# EAGLE design TheRightHandPathSVG (EAGLE 9.6.0)

## Sheet 1 of 2
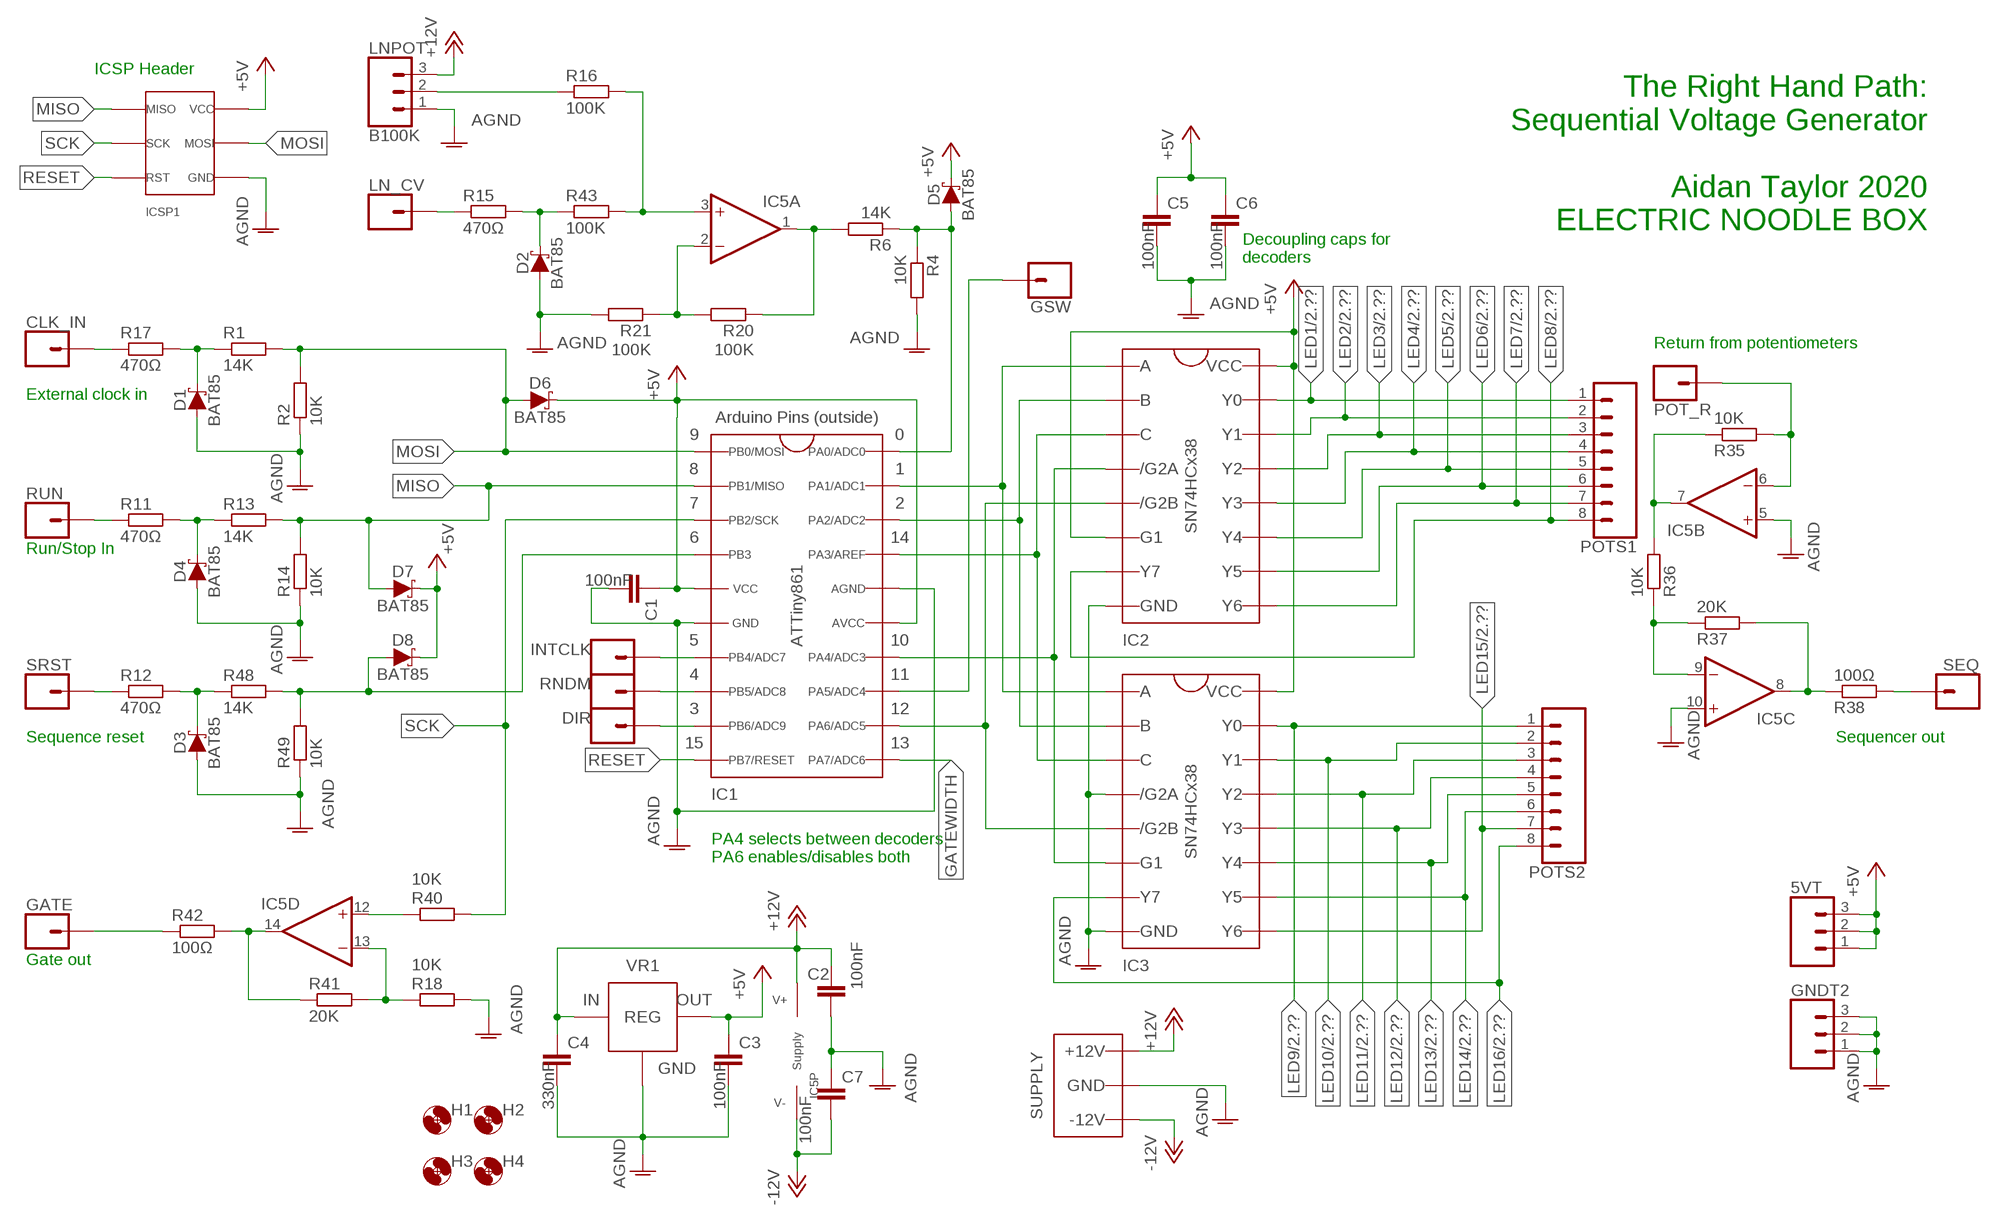
[diagram p0: schematic, sheet 1]

### Parts
5VT  3XWIREPAD  [1X03]
C1  100nF  C-EU050-025X075  [C050-025X075]
C2  100nF  C-EU050-025X075  [C050-025X075]
C3  100nF  C-EU050-025X075  [C050-025X075]
C4  330nF  C-EU050-025X075  [C050-025X075]
C5  100nF  C-EU050-025X075  [C050-025X075]
C6  100nF  C-EU050-025X075  [C050-025X075]
C7  100nF  C-EU050-025X075  [C050-025X075]
CLK_IN  1XWIREPAD  [1X01]
D1  BAT85  SCHOTTKY_DO35  [DO35-7]
D2  BAT85  SCHOTTKY_DO35  [DO35-7]
D3  BAT85  SCHOTTKY_DO35  [DO35-7]
D4  BAT85  SCHOTTKY_DO35  [DO35-7]
D5  BAT85  SCHOTTKY_DO35  [DO35-7]
D6  BAT85  SCHOTTKY_DO35  [DO35-7]
D7  BAT85  SCHOTTKY_DO35  [DO35-7]
D8  BAT85  SCHOTTKY_DO35  [DO35-7]
DIR  1XWIREPAD  [1X01]
GATE  1XWIREPAD  [1X01]
GNDT2  3XWIREPAD  [1X03]
GSW  1XWIREPAD  [1X01]
H1  MOUNT-HOLE3.2  [3,2]
H2  MOUNT-HOLE3.2  [3,2]
H3  MOUNT-HOLE3.2  [3,2]
H4  MOUNT-HOLE3.2  [3,2]
IC1  ATTINY861  [DIL20]
IC2  SN74HCX38  [DIL16]
IC3  SN74HCX38  [DIL16]
IC5  TL0X4DIL  [DIL14]
ICSP1  ICSP_2.54  [2X3]
INTCLK  1XWIREPAD  [1X01]
LN_CV  1XWIREPAD  [1X01]
LNPOT  B100K  3XWIREPAD  [1X03]
POT_R  1XWIREPAD  [1X01]
POTS1  8XWIREPAD  [1X08]
POTS2  8XWIREPAD  [1X08]
R1  14K  R-EU_0207/10  [0207/10]
R2  10K  R-EU_0207/10  [0207/10]
R4  10K  R-EU_0207/10  [0207/10]
R6  14K  R-EU_0207/10  [0207/10]
R11  470Ω  R-EU_0207/10  [0207/10]
R12  470Ω  R-EU_0207/10  [0207/10]
R13  14K  R-EU_0207/10  [0207/10]
R14  10K  R-EU_0207/10  [0207/10]
R15  470Ω  R-EU_0207/10  [0207/10]
R16  100K  R-EU_0207/10  [0207/10]
R17  470Ω  R-EU_0207/10  [0207/10]
R18  10K  R-EU_0207/10  [0207/10]
R20  100K  R-EU_0207/10  [0207/10]
R21  100K  R-EU_0207/10  [0207/10]
R35  10K  R-EU_0207/10  [0207/10]
R36  10K  R-EU_0207/10  [0207/10]
R37  20K  R-EU_0207/10  [0207/10]
R38  100Ω  R-EU_0207/10  [0207/10]
R40  10K  R-EU_0207/10  [0207/10]
R41  20K  R-EU_0207/10  [0207/10]
R42  100Ω  R-EU_0207/10  [0207/10]
R43  100K  R-EU_0207/10  [0207/10]
R48  14K  R-EU_0207/10  [0207/10]
R49  10K  R-EU_0207/10  [0207/10]
RNDM  1XWIREPAD  [1X01]
RUN  1XWIREPAD  [1X01]
SEQ  1XWIREPAD  [1X01]
SRST  1XWIREPAD  [1X01]
VR1  L78L05TO92  [TO92]
WP1  COMBO_SUPPLY_HEADER  [COMBINED_POWER]

### Nets
+5V: 5VT.1 5VT.2 5VT.3 C1.1 C3.1 C5.1 C6.1 D5.C D6.C D7.C D8.C IC1.5(VCC) IC1.15(AVCC) IC2.6(6_G1) IC2.16(16_VCC) IC3.16(16_VCC) ICSP1.2(6VCC) VR1.1(VOUT) ; also sheet 2
+12V: C2.1 C4.1 IC5.4(P:V+) LNPOT.3 VR1.3(VIN) WP1.V+1(V++) WP1.V+2(V++) WP1.V+3(V++) ; also sheet 2
-12V: C7.2 IC5.11(P:V-) WP1.V-1(V--) WP1.V-2(V--) WP1.V-3(V--)
AGND: C1.2 C2.2 C3.2 C4.2 C5.2 C6.2 C7.1 D1.A D2.A D3.A D4.A GNDT2.1 GNDT2.2 GNDT2.3 IC1.6(GND) IC1.16(AGND) IC2.8(8_GND) IC3.4(4_/G2A) IC3.8(8_GND) IC5.5(B:+IN) IC5.10(C:+IN) ICSP1.6(4GND) LNPOT.1 R2.1 R4.2 R14.1 R18.2 R21.2 R49.1 VR1.2(GND) WP1.GND1(AGND) WP1.GND2(AGND) WP1.GND3(AGND) WP1.GND4(AGND) WP1.GND5(AGND) WP1.GND6(AGND) WP1.GND7(AGND) WP1.GND8(AGND) ; also sheet 2
GATEWIDTH: IC1.11(11_PA7)
LED1: IC2.15(15_Y0) POTS1.1 ; also sheet 2
LED2: IC2.14(14_Y1) POTS1.2 ; also sheet 2
LED3: IC2.13(13_Y2) POTS1.3 ; also sheet 2
LED4: IC2.12(12_Y3) POTS1.4 ; also sheet 2
LED5: IC2.11(11_Y4) POTS1.5 ; also sheet 2
LED6: IC2.10(10_Y5) POTS1.6 ; also sheet 2
LED7: IC2.9(9_Y6) POTS1.7 ; also sheet 2
LED8: IC2.7(7_Y7) POTS1.8 ; also sheet 2
LED9: IC3.15(15_Y0) POTS2.1 ; also sheet 2
LED10: IC3.14(14_Y1) POTS2.2 ; also sheet 2
LED11: IC3.13(13_Y2) POTS2.3 ; also sheet 2
LED12: IC3.12(12_Y3) POTS2.4 ; also sheet 2
LED13: IC3.11(11_Y4) POTS2.5 ; also sheet 2
LED14: IC3.10(10_Y5) POTS2.6 ; also sheet 2
LED15: IC3.9(9_Y6) POTS2.7 ; also sheet 2
LED16: IC3.7(7_Y7) POTS2.8 ; also sheet 2
MISO: D7.A IC1.2(2_PB1) ICSP1.1(1MISO) R13.2 R14.2
MOSI: D6.A IC1.1(1_PB0) ICSP1.4(5MOSI) R1.2 R2.2
N2V5REF: IC5.2(A:-IN) R20.2 R21.1
N$1: IC1.14(14_PA4) IC2.4(4_/G2A) IC3.6(6_G1)
N$2: IC1.17(17_PA3) IC2.3(3_C) IC3.3(3_C)
N$3: IC1.18(18_PA2) IC2.2(2_B) IC3.2(2_B)
N$4: IC1.19(19_PA1) IC2.1(1_A) IC3.1(1_A)
N$5: D4.C R11.2 R13.1
N$6: GSW.1 IC1.13(13_PA5)
N$8: D1.C R1.1 R17.2
N$9: D2.C R15.2 R43.1
N$11: IC1.7(7_PB4) INTCLK.1
N$13: IC1.12(12_PA6) IC2.5(5_/G2B) IC3.5(5_/G2B)
N$15: IC5.1(A:OUT) R6.2 R20.1
N$17: D5.A IC1.20(20_PA0) R4.1 R6.1
N$19: R11.1 RUN.1
N$21: D3.C R12.2 R48.1
N$23: LN_CV.1 R15.1
N$25: R12.1 SRST.1
N$27: LNPOT.2 R16.1
N$29: CLK_IN.1 R17.1
N$44: IC5.14(D:OUT) R41.1 R42.2
N$46: IC5.13(D:-IN) R18.1 R41.2
N$48: IC5.6(B:-IN) POT_R.1 R35.2
N$59: IC5.7(B:OUT) R35.1 R36.2
N$60: IC5.9(C:-IN) R36.1 R37.1
N$61: R38.2 SEQ.1
N$62: IC5.8(C:OUT) R37.2 R38.1
N$63: IC5.12(D:+IN) R40.1
N$64: GATE.1 R42.1
N$67: IC5.3(A:+IN) R16.2 R43.2
N$73: IC1.8(8_PB5) RNDM.1
N$74: DIR.1 IC1.9(9_PB6)
N$77: D8.A IC1.4(4_PB3) R48.2 R49.2
RESET: IC1.10(10_PB7) ICSP1.5(3RST)
SCK: IC1.3(3_PB2) ICSP1.3(2SCK) R40.2

### Notes on the sheet
- ICSP Header
- The Right Hand Path:
  Sequential Voltage Generator
  
  Aidan Taylor 2020
  ELECTRIC NOODLE BOX
- Decoupling caps for
  decoders
- Return from potentiometers
- External clock in
- Run/Stop In
- Sequence reset | Sequencer out
- PA4 selects between decoders
  PA6 enables/disables both
- Gate out

## Sheet 2 of 2
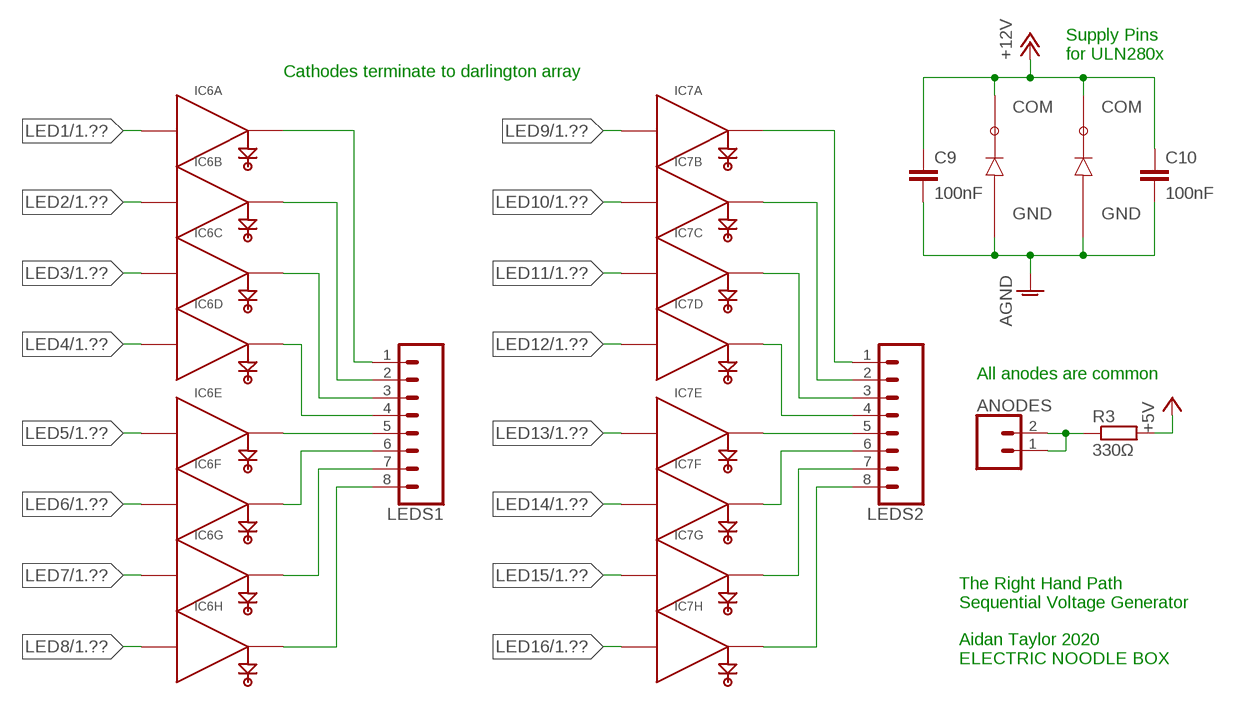
[diagram p1: schematic, sheet 2]

### Parts
ANODES  2XWIREPAD  [1X02]
C9  100nF  C-EU050-025X075  [C050-025X075]
C10  100nF  C-EU050-025X075  [C050-025X075]
IC6  ULN2801  [DIL18]
IC7  ULN2801  [DIL18]
LEDS1  8XWIREPAD  [1X08]
LEDS2  8XWIREPAD  [1X08]
R3  330Ω  R-EU_0207/10  [0207/10]

### Nets
+5V: R3.2 ; also sheet 1
+12V: C9.1 C10.1 IC6.10(COM) IC7.10(COM) ; also sheet 1
AGND: C9.2 C10.2 IC6.9(GND) IC7.9(GND) ; also sheet 1
LED1: IC6.1(A:IN) ; also sheet 1
LED2: IC6.2(B:IN) ; also sheet 1
LED3: IC6.3(C:IN) ; also sheet 1
LED4: IC6.4(D:IN) ; also sheet 1
LED5: IC6.5(E:IN) ; also sheet 1
LED6: IC6.6(F:IN) ; also sheet 1
LED7: IC6.7(G:IN) ; also sheet 1
LED8: IC6.8(H:IN) ; also sheet 1
LED9: IC7.1(A:IN) ; also sheet 1
LED10: IC7.2(B:IN) ; also sheet 1
LED11: IC7.3(C:IN) ; also sheet 1
LED12: IC7.4(D:IN) ; also sheet 1
LED13: IC7.5(E:IN) ; also sheet 1
LED14: IC7.6(F:IN) ; also sheet 1
LED15: IC7.7(G:IN) ; also sheet 1
LED16: IC7.8(H:IN) ; also sheet 1
N$7: ANODES.1 ANODES.2 R3.1
N$10: IC6.18 LEDS1.1
N$12: IC6.17 LEDS1.2
N$14: IC6.16 LEDS1.3
N$16: IC6.15 LEDS1.4
N$18: IC6.14 LEDS1.5
N$20: IC6.13 LEDS1.6
N$22: IC6.12 LEDS1.7
N$24: IC6.11 LEDS1.8
N$26: IC7.18 LEDS2.1
N$28: IC7.17 LEDS2.2
N$30: IC7.16 LEDS2.3
N$32: IC7.15 LEDS2.4
N$34: IC7.14 LEDS2.5
N$36: IC7.13 LEDS2.6
N$38: IC7.12 LEDS2.7
N$40: IC7.11 LEDS2.8

### Notes on the sheet
- Supply Pins
  for ULN280x
- Cathodes terminate to darlington array
- All anodes are common
- The Right Hand Path
  Sequential Voltage Generator
  
  Aidan Taylor 2020
  ELECTRIC NOODLE BOX

## Library data of the parts
5VT GNDT2 LNPOT = ElectricNoodleBox:3XWIREPAD
ANODES = ElectricNoodleBox:2XWIREPAD
C1-C7 C9 C10 = rcl:C-EU: CAPACITOR, European symbol; SPICEPREFIX: C
CLK_IN DIR GATE GSW INTCLK LN_CV POT_R RNDM RUN SEQ SRST = ElectricNoodleBox:1XWIREPAD
D1-D8 = ElectricNoodleBox:SCHOTTKY_DO35
H1-H4 = holes:MOUNT-HOLE: MOUNTING HOLE with drill center marker
IC1 = ElectricNoodleBox:ATTINY861
IC2 IC3 = ElectricNoodleBox:SN74HCX38
IC5 = ElectricNoodleBox:TL0X4
IC6 IC7 = ElectricNoodleBox:ULN2801
ICSP1 = ElectricNoodleBox:ICSP_2.54
LEDS1 LEDS2 POTS1 POTS2 = ElectricNoodleBox:8XWIREPAD
R1-R4 R6 R11-R18 R20 R21 R35-R38 R40-R43 R48 R49 = rcl:R-EU_: RESISTOR, European symbol; SPICEPREFIX: R
VR1 = ElectricNoodleBox:L78L05
WP1 = ElectricNoodleBox:COMBO_SUPPLY_HEADER

## Board
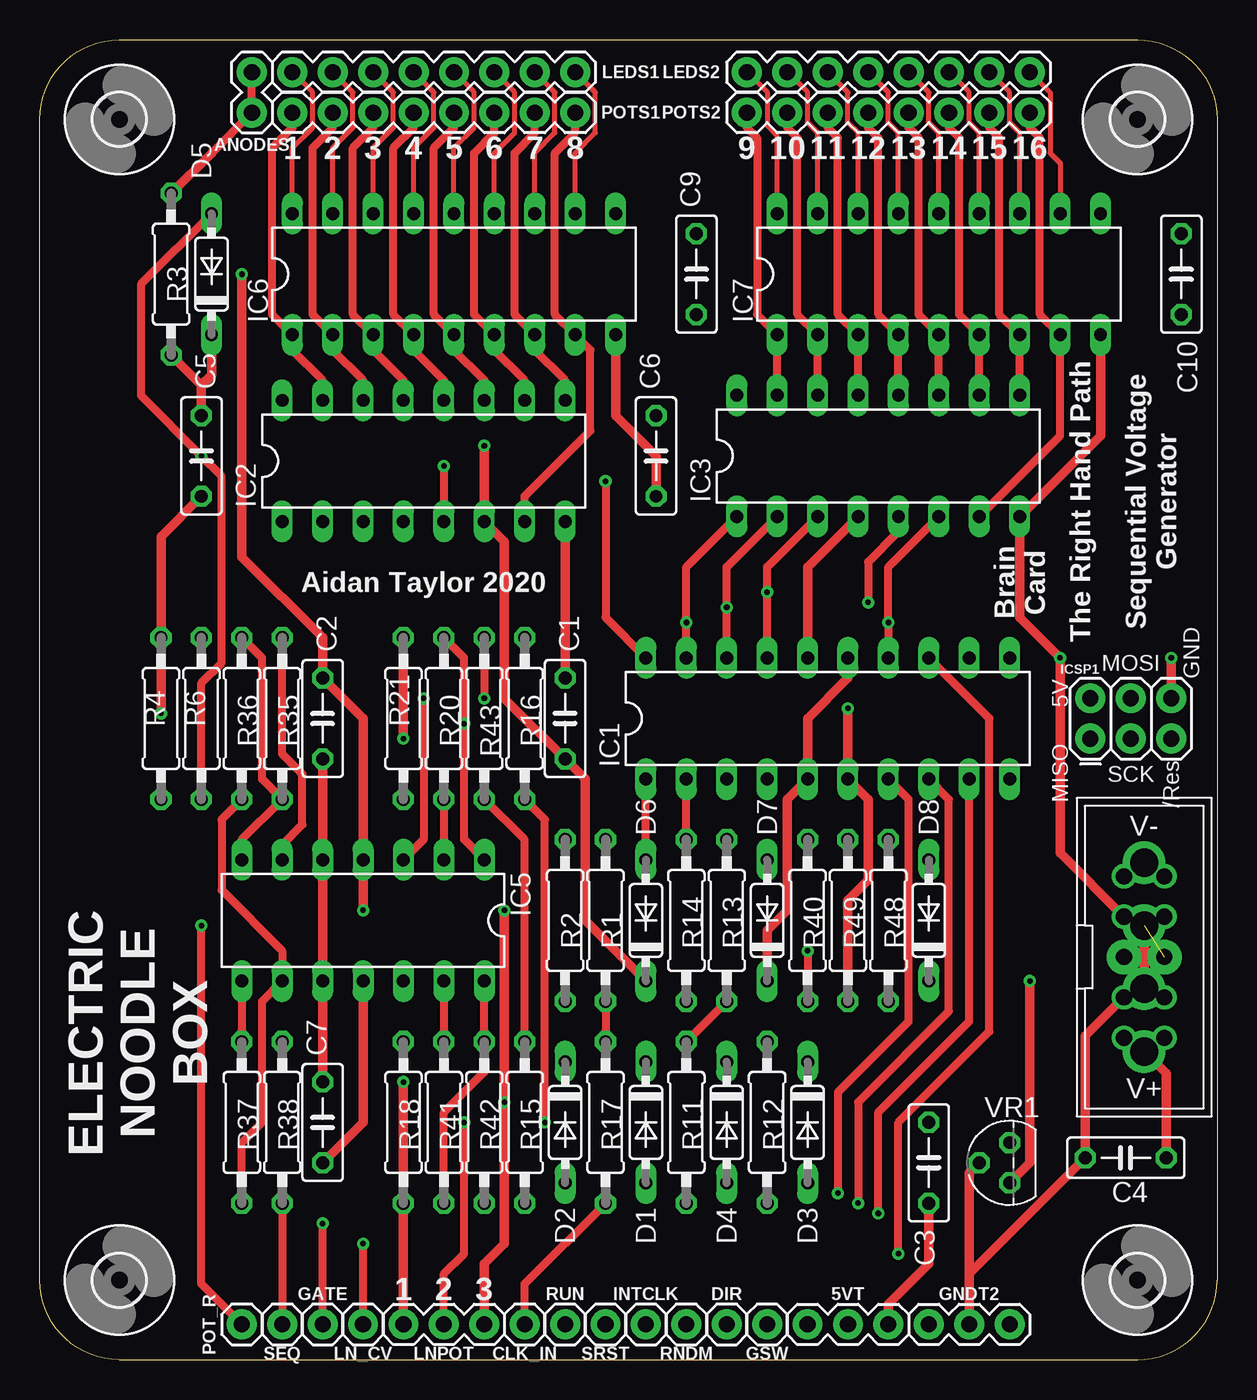
[diagram p2: board, top side]
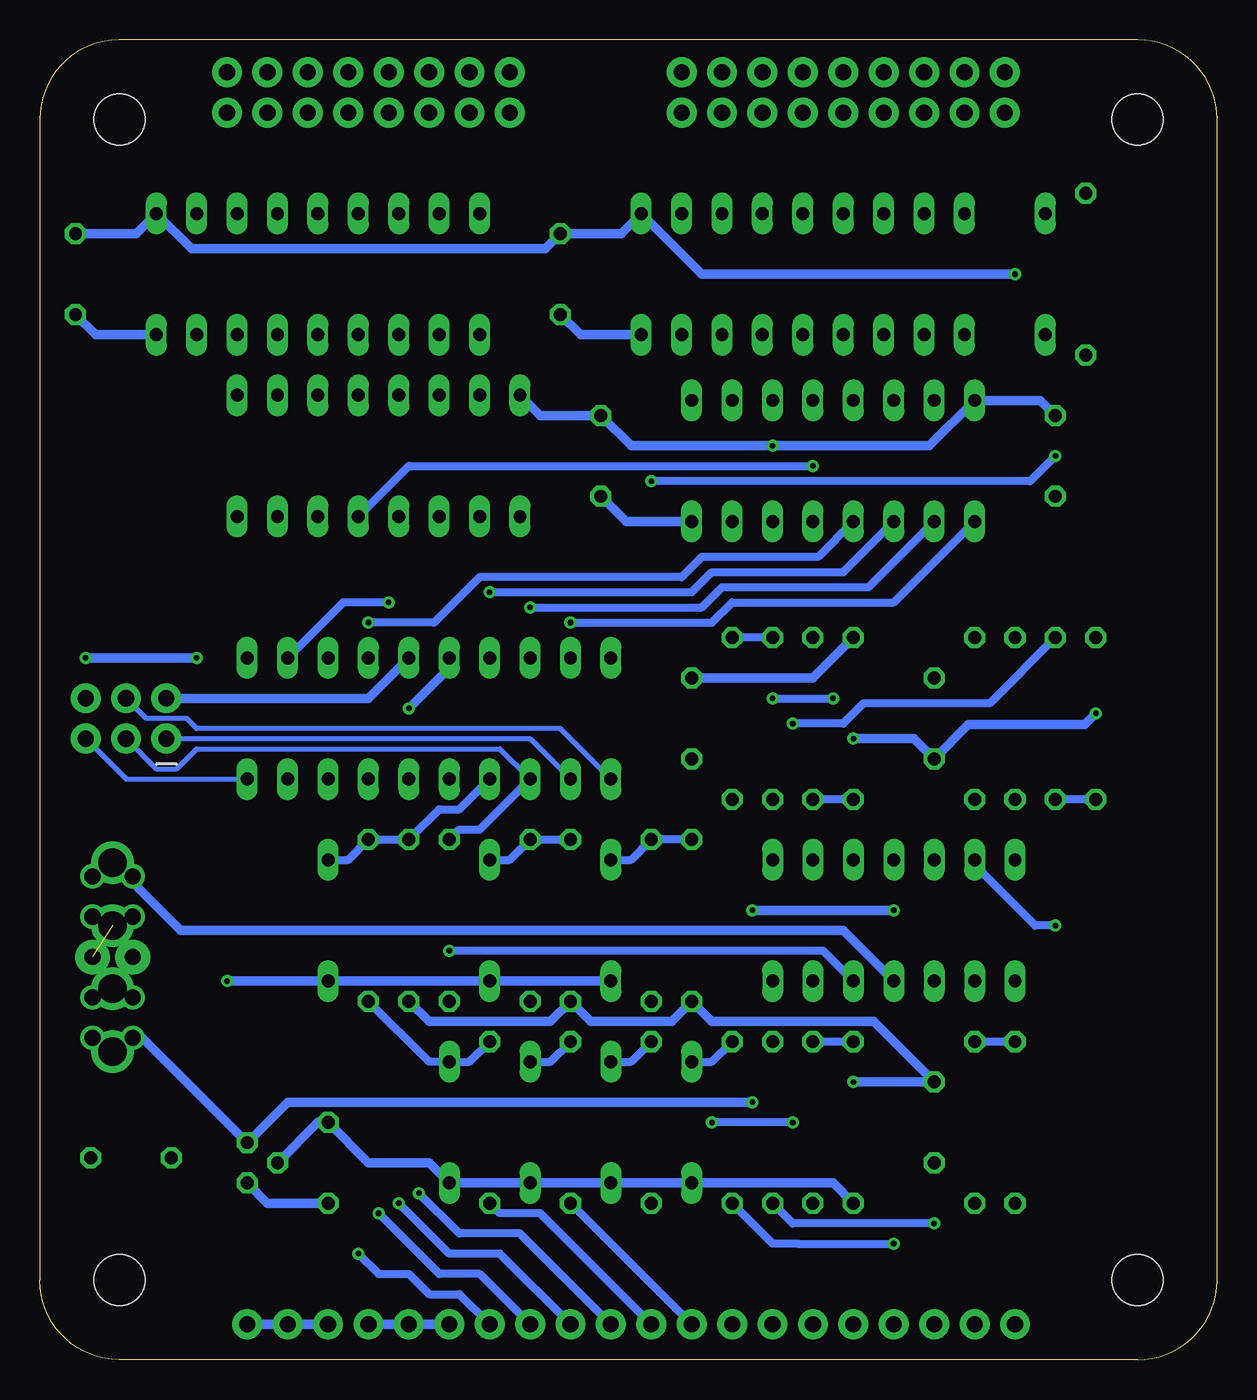
[diagram p3: board, bottom side, seen from below]

Size 74 x 83 mm. Coordinates in mm from the lower left corner, seen from the top.
Outline: 5,0 69,0 arc90 74,5 74,78 arc90 69,83 5,83 arc90 0,78 0,5 arc90 5,0
Copper layers (1*16): Top 0.035mm / dielectric 1.5mm / Bottom 0.035mm
Design rules "default": minimum track width 6mil, minimum drill 0.35mm, track to track 6mil, track to pad 6mil, pad to pad 6mil, via to via 6mil, smd to smd 6mil, copper to edge 40mil, drill to drill 6mil, minimum pad ring 10mil, minimum via ring 8mil, stop-mask expansion 4mil, vias tented up to drill 0mil, thermal gap 10mil

### Footprints (pad centres in the part's own frame; a part is rotated, then mirrored left to right if it is on the bottom)
1X03 = drill 1.016 pad 1.88: 1 0,0; 2 2.54,0; 3 5.08,0
1X02 = drill 1.016 pad 1.88: 1 0,0; 2 2.54,0
C050-025X075 = drill 0.813 octagon: 1 -2.54,0; 2 2.54,0
1X01 = drill 1.016 pad 1.88: 1 0,0
DO35-7 = drill 0.813 long: A 3.81,0; C -3.81,0
3,2 = hole 3.2: 0,0
DIL20 = drill 0.813 long: 1 -11.43,-3.81; 2 -8.89,-3.81; 3 -6.35,-3.81; 4 -3.81,-3.81; 5 -1.27,-3.81; 6 1.27,-3.81; 7 3.81,-3.81; 8 6.35,-3.81; 9 8.89,-3.81; 10 11.43,-3.81; 11 11.43,3.81; 12 8.89,3.81; 13 6.35,3.81; 14 3.81,3.81; 15 1.27,3.81; 16 -1.27,3.81; 17 -3.81,3.81; 18 -6.35,3.81; 19 -8.89,3.81; 20 -11.43,3.81
DIL16 = drill 0.813 long: 1 -8.89,-3.81; 2 -6.35,-3.81; 3 -3.81,-3.81; 4 -1.27,-3.81; 5 1.27,-3.81; 6 3.81,-3.81; 7 6.35,-3.81; 8 8.89,-3.81; 9 8.89,3.81; 10 6.35,3.81; 11 3.81,3.81; 12 1.27,3.81; 13 -1.27,3.81; 14 -3.81,3.81; 15 -6.35,3.81; 16 -8.89,3.81
DIL14 = drill 0.813 long: 1 -7.62,-3.81; 2 -5.08,-3.81; 3 -2.54,-3.81; 4 0,-3.81; 5 2.54,-3.81; 6 5.08,-3.81; 7 7.62,-3.81; 8 7.62,3.81; 9 5.08,3.81; 10 2.54,3.81; 11 0,3.81; 12 -2.54,3.81; 13 -5.08,3.81; 14 -7.62,3.81
DIL18 = drill 0.813 long: 1 -10.16,-3.81; 2 -7.62,-3.81; 3 -5.08,-3.81; 4 -2.54,-3.81; 5 0,-3.81; 6 2.54,-3.81; 7 5.08,-3.81; 8 7.62,-3.81; 9 10.16,-3.81; 10 10.16,3.81; 11 7.62,3.81; 12 5.08,3.81; 13 2.54,3.81; 14 0,3.81; 15 -2.54,3.81; 16 -5.08,3.81; 17 -7.62,3.81; 18 -10.16,3.81
2X3 = drill 1.016 pad 1.88: 1 0,0; 2 0,2.54; 3 2.54,0; 4 2.54,2.54; 5 5.08,0; 6 5.08,2.54
1X08 = drill 1.016 pad 1.88: 1 0,0; 2 2.54,0; 3 5.08,0; 4 7.62,0; 5 10.16,0; 6 12.7,0; 7 15.24,0; 8 17.78,0
0207/10 = drill 0.813 octagon: 1 -5.08,0; 2 5.08,0
TO92 = drill 0.813 octagon: 1 -1.27,0; 2 0,1.905; 3 1.27,0
COMBINED_POWER = drill 1.78: GND1 -1.98,0; GND2 1.98,0; V+1 -5.94,0; V-1 5.94,0 | drill 1.016: GND3 -2.54,1.27; GND5 2.54,1.27; GND6 -2.54,-1.27; GND8 2.54,-1.27; V+2 -5.08,1.27; V+3 -5.08,-1.27; V-2 5.08,1.27; V-3 5.08,-1.27 | drill 1.016 pad 2.184: GND4 0,1.27; GND7 0,-1.27

### Placement (x,y rotation side)
5VT  48.26,2.22 0 top
ANODES  13.34,78.42 90 top
C1  33.02,40.32 90 top
C2  17.78,40.32 270 top
C3  55.88,12.38 90 top
C4  68.26,12.7 180 top
C5  10.16,56.83 270 top
C6  38.73,56.83 270 top
C7  17.78,14.92 270 top
C9  41.27,68.26 270 top
C10  71.75,68.26 270 top
CLK_IN  30.48,2.22 0 top
D1  38.1,14.92 270 top
D2  33.02,14.92 270 top
D3  48.26,14.92 270 top
D4  43.18,14.92 270 top
D5  10.79,68.26 90 top
D6  38.1,27.62 90 top
D7  45.72,27.62 90 top
D8  55.88,27.62 90 top
DIR  43.18,2.22 0 top
GATE  17.78,2.22 0 top
GNDT2  55.88,2.22 0 top
GSW  45.72,2.22 0 top
H1  5,5 0 top
H2  69,78 0 top
H3  5,78 0 top
H4  69,5 0 top
IC1  49.53,40.32 0 top
IC2  24.13,56.52 0 top
IC3  52.7,56.83 0 top
IC5  20.32,27.62 180 top
IC6  26.04,68.26 0 top
IC7  56.52,68.26 0 top
ICSP1  66.04,39.05 0 top
INTCLK  38.1,2.22 0 top
LEDS1  15.88,80.96 0 top
LEDS2  44.45,80.96 0 top
LN_CV  20.32,2.22 0 top
LNPOT  22.86,2.22 0 top
POT_R  12.7,2.22 0 top
POTS1  15.88,78.42 0 top
POTS2  44.45,78.42 0 top
R1  35.56,27.62 90 top
R2  33.02,27.62 90 top
R3  8.26,68.26 270 top
R4  7.62,40.32 90 top
R6  10.16,40.32 90 top
R11  40.64,14.92 90 top
R12  45.72,14.92 90 top
R13  43.18,27.62 90 top
R14  40.64,27.62 90 top
R15  30.48,14.92 90 top
R16  30.48,40.32 90 top
R17  35.56,14.92 90 top
R18  22.86,14.92 270 top
R20  25.4,40.32 270 top
R21  22.86,40.32 90 top
R35  15.24,40.32 90 top
R36  12.7,40.32 90 top
R37  12.7,14.92 90 top
R38  15.24,14.92 270 top
R40  48.26,27.62 90 top
R41  25.4,14.92 90 top
R42  27.94,14.92 90 top
R43  27.94,40.32 90 top
R48  53.34,27.62 90 top
R49  50.8,27.62 90 top
RNDM  40.64,2.22 0 top
RUN  33.02,2.22 0 top
SEQ  15.24,2.22 0 top
SRST  35.56,2.22 0 top
VR1  60.96,12.38 90 top
WP1  69.42,25.32 90 top

### Tracks (layer width: path | path; a pad name or v marks a point on that pad's centre or on a via)
+5V  (via drill 0.35)
  Top 0.61: D7.C 45.72,26.99 46.99,28.26 46.99,35.24 IC1.5 48.26,40.32 50.8,42.86 IC1.15 | VR1.1 62.23,12.38 v62.23,23.81 | 5VT.3 53.34,3.49 55.88,6.03 C3.1 | D6.C 34.29,27.62 34.29,36.51 C1.1 29.21,41.59 29.21,51.44 IC2.6 v27.94,57.47 | R3.2 10.16,61.28 | C5.1 10.16,61.28 | 10.16,61.28 10.79,61.91 D5.C
  Bottom 0.61: D6.C D7.C D8.C v62.23,23.81 | C3.1 59.69,9.84 VR1.1 | 5VT.1 5VT.2 5VT.3 | ICSP1.2 53.34,41.59 IC1.15 | C5.1 11.11,60.33 IC2.16 18.1,57.47 v27.94,57.47 36.83,57.47 C6.1 42.55,59.37 IC3.16
+12V  (via drill 0.35)
  Top 0.61: LNPOT.3 27.94,6.03 29.21,7.3 v29.21,16.19 v29.21,28.26 | v20.32,28.26 IC5.4 20.32,40.32 C2.1 17.78,45.4 12.7,50.48 v12.7,68.26 | C4.1 70.8,18 WP1.V+1 | WP1.V+1 69.83,19.38 WP1.V+3 | WP1.V+1 69.01,19.38 WP1.V+2
  Bottom 0.61: v29.21,28.26 v20.32,28.26 | v29.21,16.19 58.42,16.19 VR1.3 67.55,20.24 WP1.V+2 | C10.1 67.94,70.8 IC7.10 64.45,69.85 42.23,69.85 C9.1 37.47,70.8 IC6.10 32.38,68.26 v12.7,68.26
-12V
  Top 0.61: C7.2 20.32,14.92 IC5.11 | WP1.V-3 69.83,31.26 WP1.V-1 68.56,30.4 WP1.V-2
  Bottom 0.61: IC5.11 23.5,26.99 65.15,26.99 WP1.V-1
AGND  (via drill 0.35)  (1 unrouted)
  Top 0.61: C2.2 IC5.5 IC5.10 C7.1 | LNPOT.1 R18.2 v22.86,17.46 | R49.1 50.8,28.89 52.07,30.16 52.07,35.24 IC1.6 v50.8,40.96 | 58.42,5.4 58.42,11.75 VR1.2 | ICSP1.6 v71.12,44.13 | v22.86,39.05 R21.2 | IC1.16 48.26,49.85 IC3.4 | C1.2 IC2.8 | IC7.9 66.67,58.1 IC3.8 61.59,46.67 v64.14,44.13 64.14,31.88 WP1.GND5 68.86,27.86 WP1.GND2 | C6.2 38.73,56.83 36.2,59.37 IC6.9 | WP1.GND2 69.98,27.86 WP1.GND8 | WP1.GND2 WP1.GND1 | WP1.GND4 WP1.GND7 | WP1.GND1 68.86,22.78 WP1.GND3 65.72,20.35 C4.2 58.42,5.4 | WP1.GND1 69.98,22.78 WP1.GND6 | 58.42,5.4 GNDT2.2 | v7.62,40.64 R4.2 7.62,51.75 C5.2
  Bottom 0.61: R18.2 24.13,11.11 D2.A D1.A D4.A D3.A 49.53,12.38 53.34,12.38 C3.2 56.52,14.92 VR1.2 | v22.86,17.46 C7.1 21.59,21.27 31.75,21.27 R2.1 34.29,21.27 39.37,21.27 R14.1 41.91,21.27 49.53,21.27 R49.1 | GNDT2.1 GNDT2.2 GNDT2.3 | v64.14,44.13 v71.12,44.13 | v22.86,39.05 19.05,39.05 C2.2 15.63,39.93 8.33,39.93 v7.62,40.64 | R21.2 25.4,42.86 C1.2 | IC6.9 40.01,64.45 C9.2 | IC7.9 70.48,64.45 C10.2 | IC2.8 37.15,52.7 C6.2 | v50.8,40.96 48.26,43.5 IC1.16
LED1
  Top 0.508: IC2.15 17.78,61.59 15.88,63.5 IC6.1 14.61,65.72 14.61,76.2 15.88,77.47 POTS1.1
LED2
  Top 0.508: IC2.14 20.32,61.59 18.41,63.5 IC6.2 17.14,65.72 17.14,76.2 18.41,77.47 POTS1.2
LED3
  Top 0.508: IC2.13 22.86,61.59 20.95,63.5 IC6.3 19.68,65.72 19.68,76.2 20.95,77.47 POTS1.3
LED4
  Top 0.508: IC2.12 25.4,61.59 23.5,63.5 IC6.4 22.23,65.72 22.23,76.2 23.5,77.47 POTS1.4
LED5
  Top 0.508: IC2.11 27.94,61.59 26.04,63.5 IC6.5 24.77,65.72 24.77,76.2 26.04,77.47 POTS1.5
LED6
  Top 0.508: IC2.10 30.48,61.59 28.57,63.5 IC6.6 27.3,65.72 27.3,75.88 28.57,77.15 POTS1.6
LED7
  Top 0.508: IC2.9 33.02,61.59 31.11,63.5 IC6.7 29.84,65.72 29.84,75.88 31.11,77.15 POTS1.7
LED8
  Top 0.508: IC2.7 30.48,54.29 34.61,58.42 34.61,63.5 IC6.8 32.38,65.72 32.38,75.88 33.66,77.15 POTS1.8
LED9
  Top 0.508: IC3.15 IC7.1 45.09,65.72 45.09,76.83 44.45,77.47 POTS2.1
LED10
  Top 0.508: IC3.14 IC7.2 47.62,65.72 47.62,76.83 46.99,77.47 POTS2.2
LED11
  Top 0.508: IC3.13 IC7.3 50.16,65.72 50.16,76.83 49.53,77.47 POTS2.3
LED12
  Top 0.508: IC3.12 IC7.4 52.7,65.72 52.7,76.83 52.07,77.47 POTS2.4
LED13
  Top 0.508: IC3.11 IC7.5 55.24,65.72 55.24,76.83 54.61,77.47 POTS2.5
LED14
  Top 0.508: IC3.10 IC7.6 57.78,65.72 57.78,76.83 57.15,77.47 POTS2.6
LED15
  Top 0.508: IC3.9 IC7.7 60.33,65.72 60.33,76.83 59.69,77.47 POTS2.7
LED16
  Top 0.508: IC3.7 64.14,58.1 IC7.8 62.87,65.72 62.87,76.83 62.23,77.47 POTS2.8
MISO
  Top 0.508: R14.2 IC1.2
  Bottom 0.305: ICSP1.1 43.18,39.05 IC1.2
  Bottom 0.508: D7.A 44.45,31.43 R13.2 R14.2
MOSI
  Top 0.508: D6.A IC1.1
  Bottom 0.305: IC1.1 41.27,39.69 64.14,39.69 64.77,40.32 67.31,40.32 ICSP1.4
  Bottom 0.508: D6.A 36.83,31.43 R1.2 R2.2
N2V5REF
  Top 0.508: R20.2 IC5.2
  Bottom 0.508: R21.1 R20.2
N$1  (via drill 0.35)
  Top 0.508: IC1.14 v53.34,46.35 53.34,49.85 IC3.6
  Bottom 0.508: IC2.4 25.08,50.48 32.38,50.48 33.66,49.21 46.35,49.21 49.21,46.35 v53.34,46.35
N$2  (via drill 0.35)
  Top 0.508: IC1.17 v45.72,48.26 45.72,49.85 IC3.3
  Bottom 0.508: v45.72,48.26 33.02,48.26 31.75,49.53 23.5,49.53 IC2.3
N$3  (via drill 0.35)
  Top 0.508: IC1.18 v43.18,47.31 43.18,49.85 IC3.2
  Bottom 0.508: v43.18,47.31 32.38,47.31 31.11,48.58 21.91,48.58 IC2.2
N$4  (via drill 0.35)
  Top 0.508: IC1.19 v40.64,46.35 40.64,49.85 IC3.1
  Bottom 0.508: v40.64,46.35 31.75,46.35 30.48,47.62 20.32,47.62 IC2.1
N$5
  Top 0.508: R11.2 R13.1
  Bottom 0.508: D4.C 41.91,18.73 R11.2
N$6  (via drill 0.35)
  Top 0.508: v53.98,6.67 53.98,14.92 59.69,20.64 59.69,40.32 IC1.13
  Bottom 0.508: GSW.1 47.62,4.13 49.53,4.13 50.8,5.4 52.7,5.4 v53.98,6.67
N$7
  Top 0.508: 10.79,75.88 ANODES.1 ANODES.2
  Top 0.61: R3.1 10.79,75.88
N$8
  Top 0.508: R1.1 R17.2
  Bottom 0.508: D1.C 36.83,18.73 R17.2
N$9
  Top 0.508: R43.1 30.48,32.7 R15.2
  Bottom 0.508: D2.C 31.75,18.73 R15.2
N$10
  Top 0.305: IC6.18 15.88,76.2 17.14,77.47 17.14,79.69 LEDS1.1
N$11  (via drill 0.35)
  Top 0.508: IC1.7 54.61,35.24 54.61,21.27 50.16,16.83 v50.16,10.48
  Bottom 0.508: INTCLK.1 43.81,7.94 47.62,7.94 v50.16,10.48
N$12
  Top 0.305: IC6.17 18.41,76.2 19.68,77.47 19.68,79.69 LEDS1.2
N$13  (via drill 0.35)
  Top 0.508: IC3.5 53.98,52.07 52.07,50.16 v52.07,47.62 | v25.4,56.2 IC2.5
  Bottom 0.508: v52.07,47.62 54.93,47.62 IC1.12 | IC3.5 50.8,56.2 v25.4,56.2
N$14
  Top 0.305: IC6.16 20.95,76.2 22.23,77.47 22.23,79.69 LEDS1.3
N$15  (via drill 0.35)
  Top 0.508: IC5.1 26.67,32.7 26.67,39.37 v26.67,40.01 26.67,44.13 R20.1
  Bottom 0.508: R6.2 14.29,41.27 22.23,41.27 23.5,40.01 v26.67,40.01
N$16
  Top 0.305: IC6.15 23.5,76.2 24.77,77.47 24.77,79.69 LEDS1.4
N$17  (via drill 0.35)
  Top 0.508: IC1.20 35.56,46.67 v35.56,55.24 | R6.1 10.16,42.55 11.43,43.81 11.43,55.56 v10.16,56.83 6.35,60.64 6.35,67.63 D5.A
  Bottom 0.508: v35.56,55.24 11.75,55.24 v10.16,56.83 | R4.1 R6.1
N$18
  Top 0.305: IC6.14 26.04,76.2 27.3,77.47 27.3,79.69 LEDS1.5
N$19
  Bottom 0.508: RUN.1 R11.1
N$20
  Top 0.305: IC6.13 28.57,75.88 29.84,77.15 29.84,79.69 LEDS1.6
N$21
  Bottom 0.508: R12.2 46.99,18.73 D3.C 49.53,18.73 R48.1
N$22
  Top 0.305: IC6.12 31.11,75.88 32.38,77.15 32.38,79.69 LEDS1.7
N$23  (via drill 0.35)
  Top 0.508: LN_CV.1 v20.32,7.3
  Bottom 0.508: v20.32,7.3 20.34,7.28 26.31,7.28 26.33,7.3 27.94,7.3 R15.1
N$24
  Top 0.305: IC6.11 33.66,75.88 34.92,77.15 34.92,79.69 LEDS1.8
N$25
  Bottom 0.508: SRST.1 42.55,9.21 45.09,9.21 R12.1
N$26
  Top 0.305: LEDS2.1 45.74,79.67 45.74,77.59 46.35,76.98 IC7.18
N$27  (via drill 0.35)
  Top 0.508: LNPOT.2 25.4,5.4 26.67,6.67 v26.67,14.92 | v31.75,14.92 31.75,33.97 R16.1
  Bottom 0.508: v26.67,14.92 v31.75,14.92
N$28
  Top 0.305: IC7.17 48.9,77.15 48.26,77.79 48.26,79.69 LEDS2.2
N$29
  Top 0.508: CLK_IN.1 30.48,4.76 R17.1
N$30
  Top 0.305: IC7.16 51.44,77.15 50.8,77.79 50.8,79.69 LEDS2.3
N$32
  Top 0.305: IC7.15 53.98,77.15 53.34,77.79 53.34,79.69 LEDS2.4
N$34
  Top 0.305: IC7.14 56.52,77.15 55.88,77.79 55.88,79.69 LEDS2.5
N$36
  Top 0.305: IC7.13 59.05,77.15 58.42,77.79 58.42,79.69 LEDS2.6
N$38
  Top 0.305: IC7.12 61.59,77.15 60.96,77.79 60.96,79.69 LEDS2.7
N$40
  Top 0.305: LEDS2.8 63.5,79.69 63.5,75.88 64.14,75.25 IC7.11
N$44
  Top 0.508: IC5.14 R42.2 27.94,18.1 25.4,15.56 R41.1
N$46
  Top 0.508: IC5.13 R41.2
  Bottom 0.508: R18.1 R41.2
N$48  (via drill 0.35)
  Top 0.508: POT_R.1 10.16,4.76 v10.16,27.3 | IC5.6 15.24,32.38 16.51,33.66 16.51,36.83 15.24,38.1 R35.2
  Bottom 0.508: v10.16,27.3 11.43,27.3 15.24,31.11 IC5.6
N$59
  Top 0.508: R36.2 13.97,44.13 13.97,36.51 R35.1 12.7,32.7 IC5.7
N$60
  Top 0.508: R36.1 11.43,33.97 11.43,29.53 15.24,25.72 IC5.9 13.97,22.54 13.97,14.92 12.7,13.65 R37.1
N$61
  Top 0.508: R38.2 SEQ.1
N$62
  Top 0.508: IC5.8 R37.2
  Bottom 0.508: R37.2 R38.1
N$63  (via drill 0.35)
  Top 0.508: v48.26,25.72 R40.1
  Bottom 0.508: v48.26,25.72 24.77,25.72 IC5.12
N$64  (via drill 0.35)
  Top 0.508: GATE.1 v17.78,8.57
  Bottom 0.508: v17.78,8.57 26.67,8.57 R42.1
N$67  (via drill 0.35)
  Top 0.508: R43.2 v27.94,41.59 | v24.13,41.59 24.13,32.7 IC5.3
  Bottom 0.508: R43.2 R16.2 | v27.94,41.59 v24.13,41.59
N$73  (via drill 0.35)
  Top 0.508: IC1.8 57.15,35.24 57.15,21.91 51.44,16.19 v51.44,9.84
  Bottom 0.508: RNDM.1 45.09,6.67 48.26,6.67 v51.44,9.84
N$74  (via drill 0.35)
  Top 0.508: IC1.9 58.42,21.27 52.7,15.56 v52.7,9.21
  Bottom 0.508: DIR.1 46.35,5.4 48.9,5.4 v52.7,9.21
N$77
  Bottom 0.508: D8.A 54.61,31.43 R48.2 R49.2 48.9,34.61 47.62,34.61 IC1.4
RESET
  Bottom 0.305: ICSP1.5 68.58,36.51 IC1.10
SCK
  Bottom 0.305: IC1.3 45.09,38.42 64.14,38.42 65.41,37.15 66.67,37.15 ICSP1.3
  Bottom 0.508: R40.2 47.62,33.34 46.35,33.34 IC1.3

### Text on the board
tPlace: 1 | 2 | 3 | 4 | 5 | 6 | 7 | 8 | 9 | 10 | 11 | 12 | 13 | 14 | 15 | 16 | The Right Hand Path | Sequential Voltage / Generator | Aidan Taylor 2020 | Brain / Card | MOSI | GND | 5V | MISO | SCK | /Res | ELECTRIC / NOODLE / BOX | 1 | 2 | 3